# EAGLE design usb-shock-buzzer (EAGLE 7.5.0)
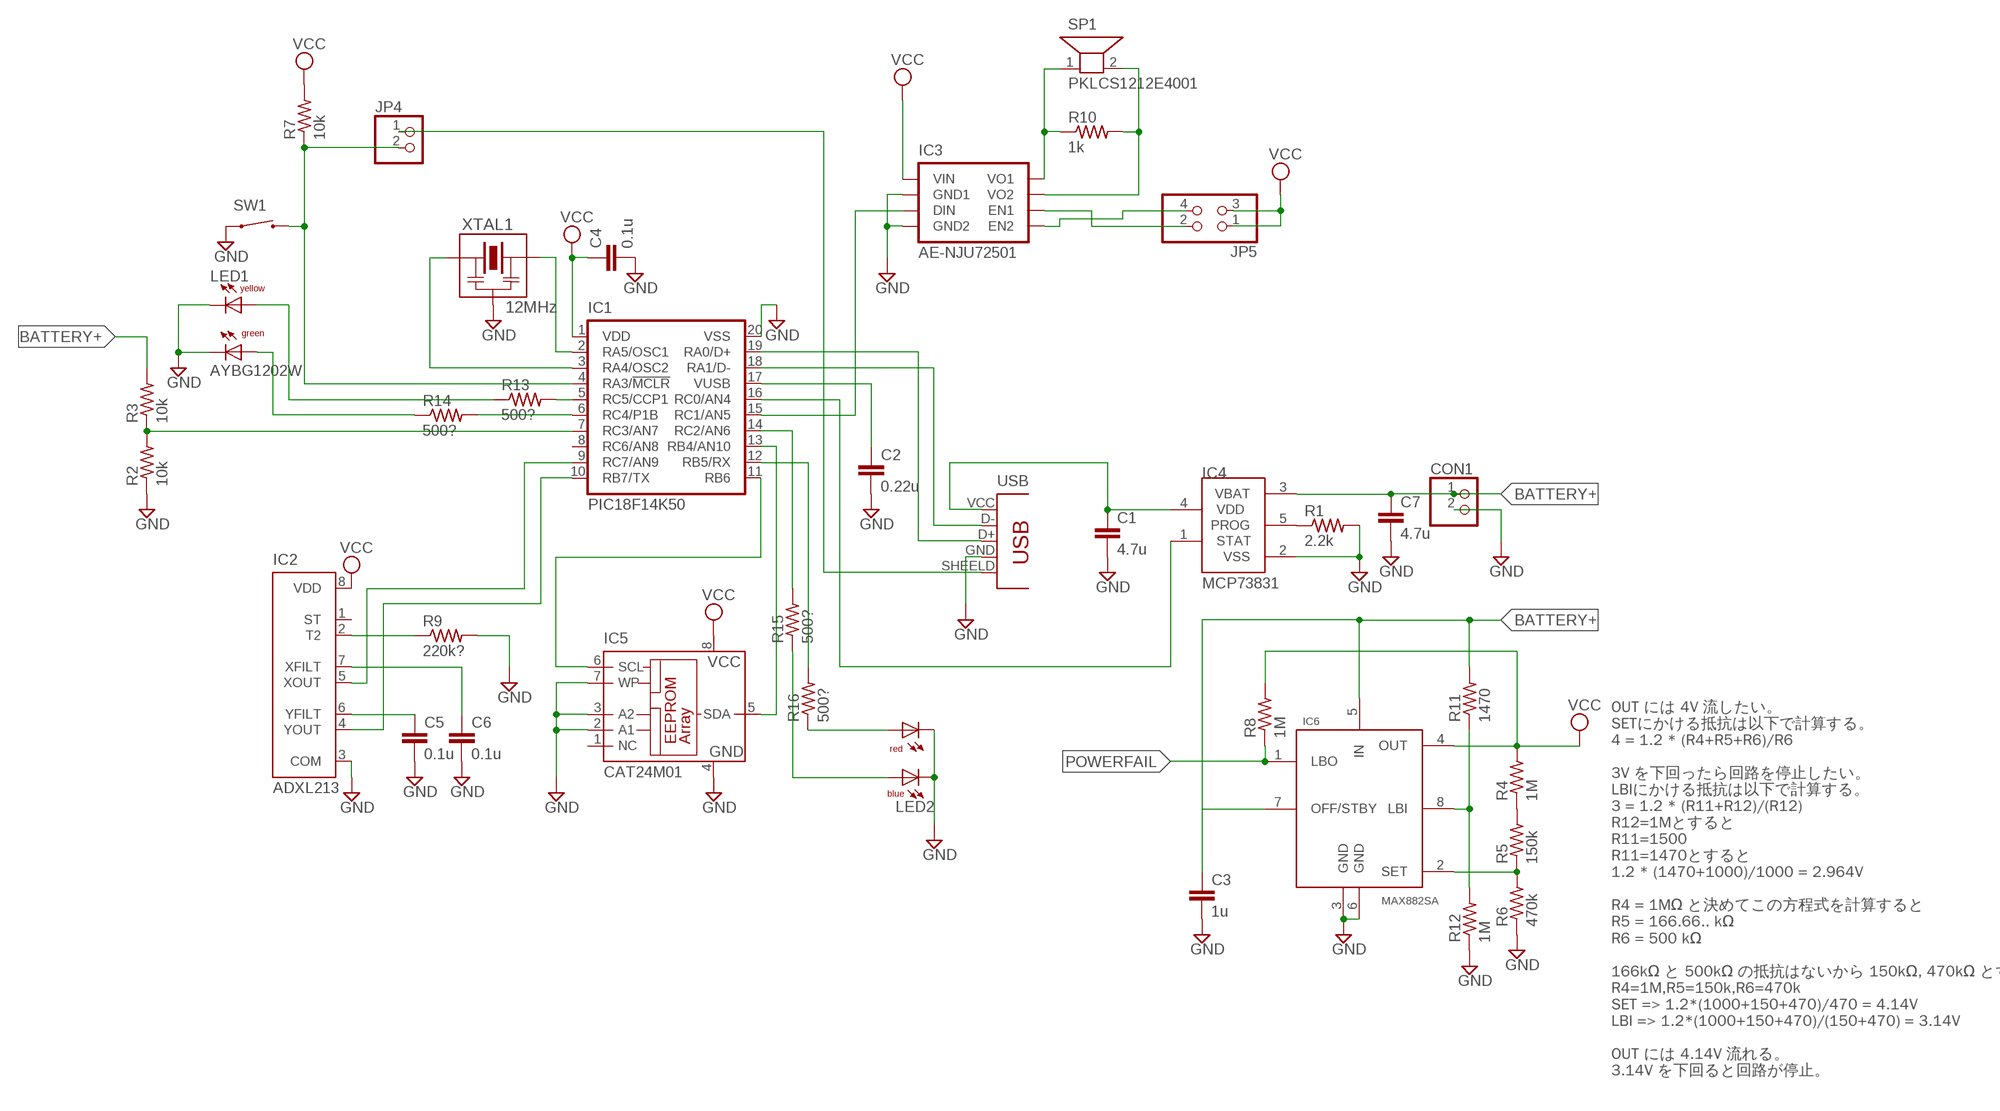
[diagram p0: schematic, sheet 1]

## Parts
C1  4.7u  C-EUC0805  [C0805]
C2  0.22u  C-EUC0805  [C0805]
C3  1u  C-EUC0805  [C0805]
C4  0.1u  C-EUC0805  [C0805]
C5  0.1u  C-EUC0805  [C0805]
C6  0.1u  C-EUC0805  [C0805]
C7  4.7u  C-EUC0805  [C0805]
CON1  PH-2PIN  [PH-2PIN]
IC1  PIC18F14K50  [SO20]
IC2  ADXL213  [LCC8]
IC3  AE-NJU72501  [AE-NJU72501]
IC4  MCP73831  [SOT23-5L]
IC5  CAT24M01  [SOIC]
IC6  MAX882SA  [8-SO]
JP4  PINHD-1X2  [1X02]
JP5  PINHD-2X2  [2X02]
LED1  AYBG1202W  [AYBG1202W]
LED2  2COLOR-BR  [SML-02]
R1  2.2k  R-US_M0805  [M0805]
R2  10k  R-US_M0805  [M0805]
R3  10k  R-US_M0805  [M0805]
R4  1M  R-US_R0805  [R0805]
R5  150k  R-US_M0805  [M0805]
R6  470k  R-US_M0805  [M0805]
R7  10k  R-US_M0805  [M0805]
R8  1M  R-US_M0805  [M0805]
R9  220k?  R-US_M0805  [M0805]
R10  1k  R-US_M1206  [M1206]
R11  1470  R-US_R0805  [R0805]
R12  1M  R-US_R0805  [R0805]
R13  500?  R-US_M0805  [M0805]
R14  500?  R-US_M0805  [M0805]
R15  500?  R-US_M0805  [M0805]
R16  500?  R-US_M0805  [M0805]
SP1  PKLCS1212E4001  [PKLCS1212E4001]
SW1  TVBP06  [TVBP06]
USB  TYPE-A+SHILED  [TYPE-A]
XTAL1  12MHz  CSTCE12M0G15L  [CSTCE]

## Nets
BATTERY+ [Power]: C3.1 C7.1 CON1.1 IC4.3(VBAT) IC6.5(IN) IC6.7(OFF/STBY) R3.2 R11.2
GND [Power]: C1.2 C2.2 C3.2 C4.2 C5.2 C6.2 C7.2 CON1.2 IC1.20(VSS) IC2.3(COM) IC3.2(GND1) IC3.4(GND2) IC4.2(VSS) IC5.2(A1) IC5.3(A2) IC5.4(GND) IC5.7(WP) IC6.3(GND) IC6.6(GND) LED1.2(CC1) LED1.4(CC2) LED2.1(CC1) LED2.3(CC2) R1.2 R2.1 R6.1 R9.2 R12.1 SW1.1 USB.GND XTAL1.2(GND)
N$1: IC3.6(EN1) JP5.2
N$2: IC1.18(RA1/D-) USB.D-
N$3: IC1.19(RA0/D+) USB.D+
N$4: IC4.5(PROG) R1.1
N$5: IC1.16(RC0/AN4) IC4.1(STAT)
N$6: JP4.1 USB.SHEELD
N$7: C2.1 IC1.17(VUSB)
N$8: IC1.7(RC3/AN7) R2.2 R3.1
N$9: R4.1 R5.2
N$10: IC1.11(RB6) IC5.6(SCL)
N$11: IC1.13(RB4/AN10) IC5.5(SDA)
N$12: C5.1 IC2.6(YFILT)
N$13: C6.1 IC2.7(XFILT)
N$14: IC1.9(RC7/AN9) IC2.5(XOUT)
N$15: IC1.10(RB7/TX) IC2.4(YOUT)
N$16: IC3.5(EN2) JP5.4
N$17: IC2.2(T2) R9.1
N$18: IC6.8(LBI) R11.1 R12.2
N$19: IC3.8(VO1) R10.1 SP1.1
N$20: IC3.7(VO2) R10.2 SP1.2
N$21: IC1.4(RA3/!MCLR!) JP4.2 R7.1 SW1.2
N$22: LED1.1(A1) R13.1
N$23: LED1.3(A2) R14.1
N$24: LED2.4(AR) R16.1
N$25: IC1.15(RC1/AN5) IC3.3(DIN)
N$26: IC1.2(RA5/OSC1) XTAL1.3(RIT)
N$27: IC1.14(RC2/AN6) R15.2
N$28: IC1.3(RA4/OSC2) XTAL1.1(LFT)
N$29: IC6.2(SET) R5.1 R6.2
N$30: IC1.5(RC5/CCP1) R13.2
N$31: IC1.6(RC4/P1B) R14.2
N$32: IC1.12(RB5/RX) R16.2
N$33: LED2.2(AB) R15.1
POWERFAIL: IC6.1(LBO) R8.1
USB_VCC [Power]: C1.1 IC4.4(VDD) USB.VCC
VCC [Power]: C4.1 IC1.1(VDD) IC2.8(VDD) IC3.1(VIN) IC5.8(VCC) IC6.4(OUT) JP5.1 JP5.3 R4.2 R7.2 R8.2
Unconnected: IC1.8(RC6/AN8) IC2.1(ST) IC5.1(NC)

## Notes on the sheet
- OUT には 4V 流したい。
  SETにかける抵抗は以下で計算する。
  4 = 1.2 * (R4+R5+R6)/R6
  
  3V を下回ったら回路を停止したい。
  LBIにかける抵抗は以下で計算する。
  3 = 1.2 * (R11+R12)/(R12)
  R12=1Mとすると
  R11=1500
  R11=1470とすると
  1.2 * (1470+1000)/1000 = 2.964V
  
  R4 = 1MΩ と決めてこの方程式を計算すると
  R5 = 166.66.. kΩ
  R6 = 500 kΩ
  
  166kΩ と 500kΩ の抵抗はないから 150kΩ, 470kΩ とする
  R4=1M,R5=150k,R6=470k
  SET => 1.2*(1000+150+470)/470 = 4.14V
  LBI => 1.2*(1000+150+470)/(150+470) = 3.14V
  
  OUT には 4.14V 流れる。
  3.14V を下回ると回路が停止。

## Library data of the parts
C1-C7 = rcl:C-EU: CAPACITOR, European symbol
CON1 = connectors:PH-2PIN
IC1 = pic18f14k50:PIC18F14K50
IC2 = adxl213:ADXL213: Low-Cost +-2 g Dual-Axis Accelerometer with Duty Cycle Output Source: http://www.analog.com/media/en/technical-documentation/data-sheets/ADXL213.pdf
IC3 = ae-nju72501:AE-NJU72501
IC4 = microchip-update:MCP73831: Miniature Single-Cell, Fully Integrated Li-Ion, Li-Polymer Charge Management Controllers
IC5 = cat24m01:CAT24M01: Serial EEPROM 1Mbit (128KB)
IC6 = max882:MAX882*: MAX882 Low-Dropout, Adjustable Linear Regulators 200 mA, 5V/3.3V This is SMD library only. Created by: Razi Raslan; Ragnar Granit Institute; Tampere University of Technology.
JP4 = pinhead:PINHD-1X2: PIN HEADER
JP5 = pinhead:PINHD-2X2: PIN HEADER
LED1 = led-smd:AYBG1202W
LED2 = led-smd:2COLOR-BR: 2color led http://akizukidenshi.com/catalog/g/gI-09437/
R1-R16 = rcl:R-US_: RESISTOR, American symbol
SP1 = pklcs1212e4001-r1:PKLCS1212E4001
SW1 = switches:TVBP06: 2pin switch. http://akizukidenshi.com/catalog/g/gP-08074/
USB = usb-connector:TYPE-A+SHILED
XTAL1 = murata-ceralok:CSTCE12M0G15L: Murata CERALOCK https://jp.rs-online.com/web/p/ceramic-resonators/7926527/

## Net classes
0 default: width 0.305 mm, drill 0.203 mm, clearance 0.254 mm
1 Power: width 0.61 mm, drill 0.508 mm, clearance 0.381 mm

## Board
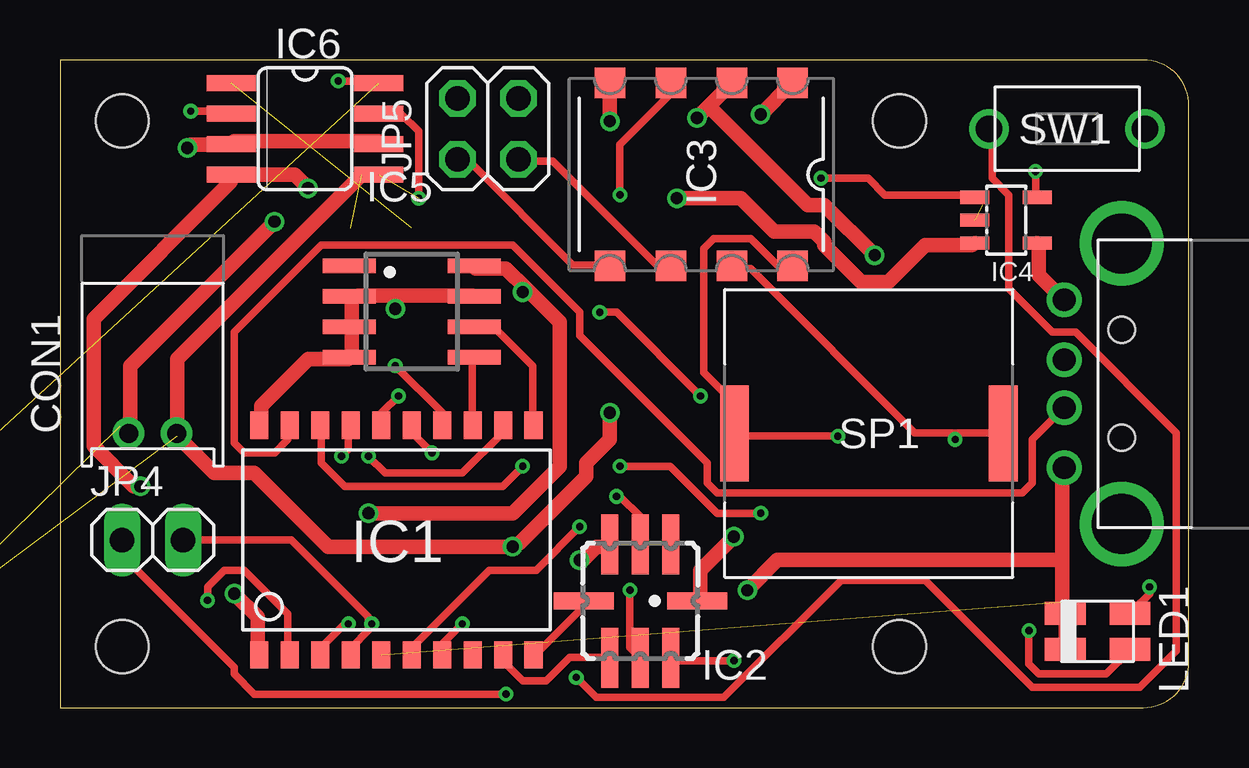
[diagram p1: board, top side]
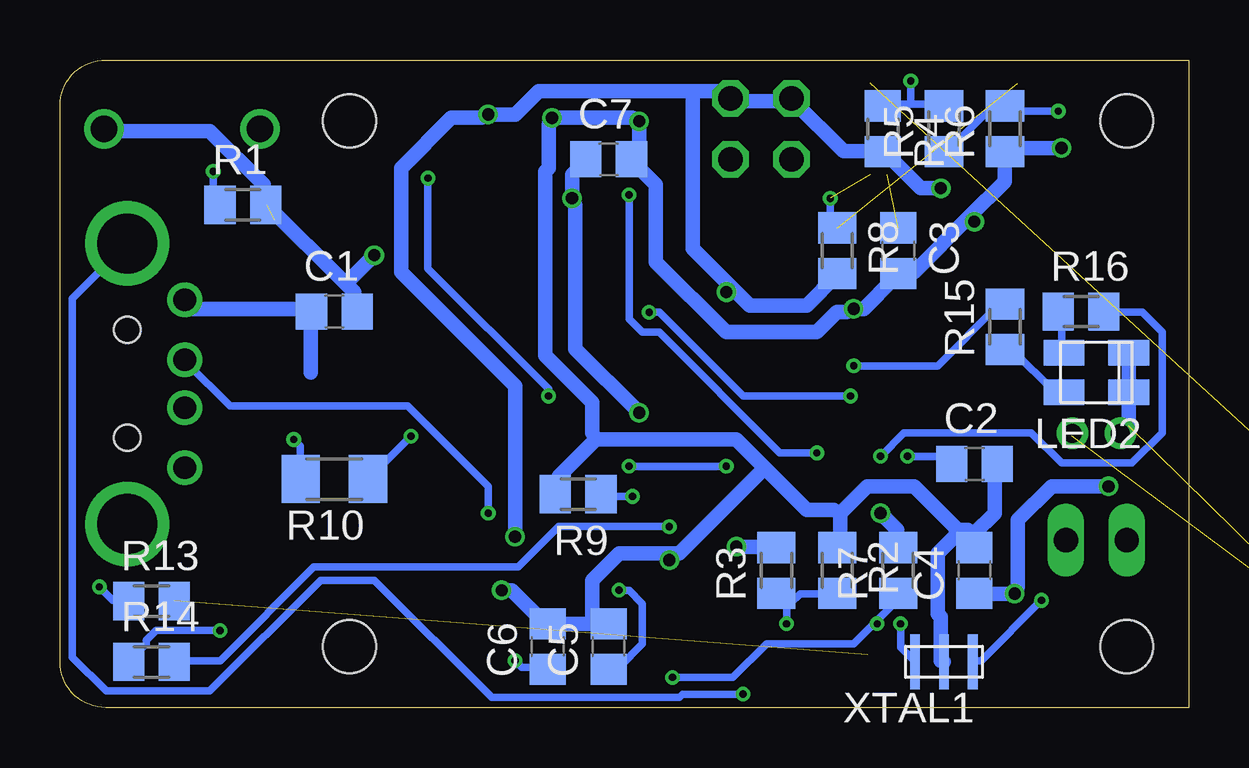
[diagram p2: board, bottom side, seen from below]

Size 47.04 x 27 mm. Coordinates in mm from the lower left corner, seen from the top.
Outline: 0,0 45.14,0 arc90 47.04,1.91 47.04,25.09 arc90 45.14,27 0,27 0,0
Copper layers (1*16): Top 0.035mm / dielectric 1.5mm / Bottom 0.035mm
Design rules "ssci_SeeedStudio_2layer_DRU_no_angle": minimum track width 6mil, minimum drill 12mil, track to track 6mil, track to pad 6mil, pad to pad 6mil, via to via 6mil, smd to smd 0mil, copper to edge 10mil, drill to drill 10mil, minimum pad ring 10mil, minimum via ring 6mil, stop-mask expansion 2mil, vias tented up to drill 25mil, thermal gap 10mil
Holes 2.2 mm at 34.98,24.46 34.98,2.54 2.59,2.54 2.59,24.46
bKeepout: area 11,11 to 17,17
tRestrict: area 0.1,22 to 5.1,27; area 32.5,22 to 37.5,27; area 32.5,0 to 37.5,5; area 0.1,0 to 5.1,5
bRestrict: area 32.5,22 to 37.5,27; area 32.5,0 to 37.5,5; area 0.1,0 to 5.1,5; area 0.1,22 to 5.1,27

### Footprints (pad centres in the part's own frame; a part is rotated, then mirrored left to right if it is on the bottom)
C0805 = smd 1.3 x 1.5: 1 -0.95,0; 2 0.95,0
PH-2PIN = drill 0.8: 1 1,0; 2 -1,0
SO20 = smd 0.762 x 1.143: 1 -5.08,-4.788; 2 -3.81,-4.788; 3 -2.54,-4.788; 4 -1.27,-4.788; 5 0,-4.788; 6 1.27,-4.788; 7 2.54,-4.788; 8 3.81,-4.788; 9 5.08,-4.788; 10 6.35,-4.788; 11 6.35,4.788; 12 5.08,4.788; 13 3.81,4.788; 14 2.54,4.788; 15 1.27,4.788; 16 0,4.788; 17 -1.27,4.788; 18 -2.54,4.788; 19 -3.81,4.788; 20 -5.08,4.788
LCC8 = smd 2.5 x 0.7: 1 -2.367,1.27; 2 -2.367,0; 3 -2.367,-1.27; 5 2.367,-1.27; 6 2.367,0; 7 2.367,1.27 | smd 0.7 x 2.5: 4 0,-2.367; 8 0,2.367
AE-NJU72501 = smd 1.27 x 1.27: 1 -3.81,3.81; 2 -3.81,1.27; 3 -3.81,-1.27; 4 -3.81,-3.81; 5 3.81,-3.81; 6 3.81,-1.27; 7 3.81,1.27; 8 3.81,3.81
SOT23-5L = smd 0.55 x 1.2: 1 -0.95,-1.3; 2 0,-1.3; 3 0.95,-1.3; 4 0.95,1.3; 5 -0.95,1.3
SOIC = smd 0.6 x 2.2: 1 -1.905,-2.6; 2 -0.635,-2.6; 3 0.635,-2.6; 4 1.905,-2.6; 5 1.905,2.6; 6 0.635,2.6; 7 -0.635,2.6; 8 -1.905,2.6
8-SO = smd 2.032 x 0.66: 1 -3.073,1.905; 2 -3.073,0.635; 3 -3.073,-0.635; 4 -3.073,-1.905; 5 3.073,-1.905; 6 3.073,-0.635; 7 3.073,0.635; 8 3.073,1.905
1X02 = drill 1.016 long: 1 -1.27,0; 2 1.27,0
2X02 = drill 1.016 octagon: 1 -1.27,-1.27; 2 -1.27,1.27; 3 1.27,-1.27; 4 1.27,1.27
AYBG1202W = smd 0.95 x 1.7: 1 -0.75,1.35; 2 -0.75,-1.35; 3 0.75,1.35; 4 0.75,-1.35
SML-02 = smd 1.7 x 1.05: 1 -1.35,0.825; 2 1.35,0.825; 3 -1.35,-0.825; 4 1.35,-0.825
M0805 = smd 1.3 x 1.6: 1 -0.95,0; 2 0.95,0
R0805 = smd 1.3 x 1.5: 1 -0.95,0; 2 0.95,0
M1206 = smd 1.6 x 2: 1 -1.4,0; 2 1.4,0
PKLCS1212E4001 = smd 1.2 x 4: 1 -5.6,0; 2 5.6,0
TVBP06 = drill 1.1: 1 -3.25,0; 2 3.25,0
TYPE-A = drill 0.95: D+ 1,0; D- -1,0; GND 3.5,0; VCC -3.5,0 | drill 2.5: SHEELD -5.85,2.4; SHEELD2 5.85,2.4 | hole 1.1: -2.25,2.4; 2.25,2.4
CSTCE = smd 0.4 x 2.3: 1 1.2,0; 2 0,0; 3 -1.2,0

### Placement (x,y rotation side)
C1  35.61,16.51 0 bottom
C2  8.94,10.16 0 bottom
C3  12.11,19.05 270 bottom
C4  8.94,5.71 90 bottom
C5  24.18,2.54 90 bottom
C6  26.72,2.54 90 bottom
C7  24.18,22.86 0 bottom
CON1  3.86,11.43 0 top
IC1  13.38,6.99 0 top
IC2  24.18,4.45 270 top
IC3  26.72,22.23 270 top
IC4  39.42,20.32 270 top
IC5  14.66,16.51 270 top
IC6  10.21,24.13 0 top
JP4  3.86,6.99 0 top
JP5  17.83,24.13 180 top
LED1  43.23,3.17 270 top
LED2  3.86,13.97 180 bottom
R1  39.42,20.95 0 bottom
R2  14.66,5.71 270 bottom
R3  17.2,5.71 90 bottom
R4  12.75,24.13 270 bottom
R5  10.21,24.13 90 bottom
R6  7.67,24.13 90 bottom
R7  12.11,5.71 90 bottom
R8  14.66,19.05 270 bottom
R9  25.45,8.89 180 bottom
R10  35.61,9.53 180 bottom
R11  -26.62,-11.43 0 top  (outside the outline)
R12  -26.62,-17.78 0 top  (outside the outline)
R13  43.23,4.45 0 bottom
R14  43.23,1.91 0 bottom
R15  7.67,15.88 90 bottom
R16  4.5,16.51 0 bottom
SP1  33.7,11.43 0 top
SW1  41.96,24.13 180 top
USB  41.84,13.5 270 top
XTAL1  10.21,1.91 180 bottom

### Tracks (layer width: path | path; a pad name or v marks a point on that pad's centre or on a via)
BATTERY+  (via drill 0.3, 0.51)  (3 unrouted)
  Top 0.305: v14.95,21.23 14.95,24.03 14.25,24.73 13.41,24.73 IC6.7
  Top 0.61: v25.7,21.23 28.36,21.23 29.76,19.84 31.43,19.84 31.85,19.42 31.85,19.28 33.39,17.74 34.51,17.74 36.04,19.28 38,19.28 IC4.3 | IC6.5 12.57,22.21 4.89,14.53 4.89,11.73 CON1.1 4.89,11.32 6.43,9.78 8.1,9.78 11.18,6.71 v18.86,6.71 19.14,6.84 21.93,9.64 21.93,10.2 22.91,11.18 v22.91,12.29
  Bottom 0.305: 14.95,20.12 v14.95,21.23
  Bottom 0.61: C7.1 25.15,22.77 25.7,22.21 v25.7,21.23 25.56,20.95 25.56,14.95 v22.91,12.29 | v18.86,6.71 17.32,6.71 R3.2
GND  (via drill 0.51)  (2 unrouted)
  Top 0.61: IC1.20 8.38,11.87 8.38,12.57 10.34,14.53 12.01,14.53 IC5.4 12.15,14.81 12.15,15.79 IC5.3 12.15,16.07 12.15,17.04 IC5.2 12.43,17.18 13.97,17.18 | 13.97,17.18 17.18,17.18 IC5.7 | IC6.6 13.27,23.61 7.26,23.61 IC6.3 6.84,23.47 5.45,23.47 v5.31,23.33 | v8.94,20.26 2.93,14.25 2.93,11.46 CON1.2 | v13.97,16.62 13.97,17.18 | LED1.4 41.91,2.52 41.91,3.91 LED1.2 41.77,4.19 41.77,6.15 | 41.77,6.15 41.77,9.92 USB.GND | v22.91,24.45 IC3.4 | v26.54,24.59 27.03,25.08 | 27.03,25.08 IC3.2 | v21.65,6.15 21.79,6.15 22.35,6.71 22.91,6.71 IC2.3 | 41.77,6.15 29.9,6.15 v28.64,4.89 | v33.95,18.86 31.85,20.95 31.15,20.95 27.03,25.08
  Bottom 0.61: LED2.3 2.51,14.67 2.51,13.27 LED2.1 2.51,12.85 2.51,11.73 2.79,11.46 CON1.2 | 9.15,20.47 7.68,21.93 7.68,23.05 R6.1 7.4,23.33 v5.31,23.33 | 9.15,20.47 11.45,18.16 12.01,18.16 C3.2 12.29,17.88 13.55,16.62 v13.97,16.62 14.25,16.48 14.67,16.48 15.51,15.65 19.28,15.65 22.21,18.58 22.21,21.79 23.05,22.63 C7.2 23.19,22.91 22.91,23.19 v22.91,24.45 23.19,24.59 v26.54,24.59 26.68,24.31 26.68,22.49 26.82,22.35 26.82,14.67 24.87,12.71 24.87,11.46 24.73,11.18 | v8.94,20.26 9.15,20.47 | 35.13,17.67 38.42,20.95 R1.2 38.56,21.23 38.56,21.79 40.79,24.03 45.12,24.03 SW1.1 | 35.13,17.67 34.78,17.32 34.78,16.62 C1.2 | 8.94,7.26 8.1,8.1 8.1,10.06 C2.2 | C4.2 8.94,7.26 | 14.53,8.1 14.53,6.71 R2.1 | 14.53,8.1 13.41,9.22 11.45,9.22 9.64,7.4 | 9.64,7.4 9.22,7.4 8.94,7.26 | 24.73,11.18 26.26,9.64 26.26,8.94 R9.2 | 24.73,11.18 18.86,11.18 17.67,9.99 | 17.67,9.99 15.92,8.24 14.81,8.24 14.53,8.1 | XTAL1.2 10.34,1.96 10.34,3.77 10.48,3.91 10.48,6.43 9.78,7.12 9.64,7.4 | 21.65,6.43 21.23,6.43 17.67,9.99 | 21.65,6.43 23.75,6.43 24.87,5.31 24.87,3.77 C5.2 24.31,3.49 26.68,3.49 C6.2 26.96,3.63 28.22,4.89 v28.64,4.89 | v21.65,6.15 21.65,6.43 | v33.95,18.86 35.13,17.67
N$1
  Top 0.305: IC3.6 25.42,18.44 24.87,18.44 20.53,22.77 19.14,22.77 JP5.2
N$2  (via drill 0.3)
  Top 0.305: v19.28,10.06 18.44,9.22 11.87,9.22 10.9,10.2 10.9,11.73 IC1.18 | v23.33,10.06 25.42,10.06 27.38,8.1 v29.2,8.1
  Bottom 0.305: v23.33,10.06 v19.28,10.06 | v29.2,8.1 29.2,9.22 32.55,12.57 39.95,12.57 41.77,14.39 USB.D-
N$3
  Top 0.305: IC1.19 9.5,11.73 9.5,11.18 8.94,10.62 7.68,10.62 7.26,11.04 7.26,15.65 10.9,19.28 18.86,19.28 21.65,16.48 21.65,15.51 26.96,10.2 26.96,9.36 27.38,8.94 40.09,8.94 40.51,9.36 40.51,11.18 41.77,12.43 USB.D+
N$4  (via drill 0.3)
  Top 0.305: v40.65,22.35 40.65,21.37 IC4.5
  Bottom 0.305: v40.65,22.35 40.65,21.23 R1.1
N$5  (via drill 0.3)
  Top 0.305: v14.11,12.99 13.41,12.29 13.41,11.87 IC1.16 | v22.49,16.48 23.19,16.48 v26.68,12.99 | v31.71,22.07 33.67,22.07 34.37,21.37 38,21.37 IC4.1
  Bottom 0.305: v14.11,12.99 18.58,12.99 22.07,16.48 v22.49,16.48 | v26.68,12.99 26.68,13.27 31.71,18.3 v31.71,22.07
N$6  (via drill 0.3)
  Top 0.305: v18.58,0.56 8.1,0.56 7.26,1.4 7.26,1.68 2.65,6.29 2.65,6.99 JP4.1
  Bottom 0.305: v18.58,0.56 21.09,0.56 21.23,0.42 29.06,0.42 33.95,5.31 36.18,5.31 40.79,0.7 45.12,0.7 46.52,2.1 46.52,17.04 44.28,19.28 USB.SHEELD
N$7  (via drill 0.3)
  Top 0.305: v11.73,10.48 12.01,10.76 12.01,11.73 IC1.17
  Bottom 0.305: v11.73,10.48 10.2,10.48 9.92,10.2 C2.1
N$8  (via drill 0.3)
  Top 0.305: IC1.7 15.92,2.65 v16.76,3.49
  Bottom 0.305: v16.76,3.49 16.76,4.33 17.18,4.75 R3.1 16.62,4.33 16.2,4.75 R2.2
N$9  (via drill 0.3)
  Top 0.305: v11.59,26.12 13.27,26.12
  Bottom 0.305: 11.59,25.15 10.34,25.15 R5.2 | 11.59,25.15 12.71,25.15 R4.1 | 11.59,25.15 v11.59,26.12
N$10
  Top 0.305: IC1.11 19.7,11.87 19.7,14.25 18.16,15.79 17.32,15.79 IC5.6
N$11
  Top 0.305: IC1.13 17.18,11.87 17.18,14.53 IC5.5
N$12  (via drill 0.3)
  Top 0.305: v23.75,4.89 23.75,2.52 24.17,2.1 IC2.6
  Bottom 0.305: v23.75,4.89 23.33,4.89 22.77,4.33 22.77,2.65 23.75,1.68 24.17,1.68 C5.1
N$13  (via drill 0.3)
  Top 0.305: v28.08,1.96 25.56,1.96 IC2.7
  Bottom 0.305: v28.08,1.96 27.8,1.68 26.82,1.68 C6.1
N$14
  Top 0.305: IC1.9 18.58,2.1 18.58,1.82 19.28,1.12 20.26,1.12 21.23,2.1 22.91,2.1 IC2.5
N$15
  Top 0.305: IC1.10 19.84,2.23 21.93,4.33 IC2.4
N$16
  Top 0.305: IC3.5 22.91,18.44 21.37,18.44 17.04,22.77 16.62,22.77 JP5.4
N$17  (via drill 0.3)
  Top 0.305: v23.19,8.8 23.33,8.8 24.17,7.96 24.17,6.84 IC2.2
  Bottom 0.305: v23.19,8.8 24.45,8.8 R9.1
N$18  (2 unrouted)
N$19  (via drill 0.3)
  Top 0.305: IC3.8 30.45,18.44 29.9,18.44 28.78,19.56 27.24,19.56 26.82,19.14 26.82,13.97 28.08,12.71 28.08,11.46 SP1.1 28.22,11.32 v32.41,11.32
  Bottom 0.305: v32.41,11.32 34.09,9.64 R10.1
N$20  (via drill 0.3)
  Top 0.305: 37.3,11.46 39.26,11.46 SP1.2 | 37.3,11.46 35.62,11.46 28.78,18.3 28.08,18.3 IC3.7 | v37.3,11.18 37.3,11.46
  Bottom 0.305: v37.3,11.18 37.02,10.9 37.02,9.64 R10.2
N$21  (via drill 0.3)
  Top 0.305: 12.85,3.49 12.85,3.77 9.64,6.99 JP4.2 | 12.85,3.49 12.85,3.21 12.15,2.52 12.15,2.23 IC1.4 | v12.99,3.49 12.85,3.49 | v21.51,1.26 22.35,0.42 27.66,0.42 32.55,5.31 36.04,5.31 40.51,0.84 44.98,0.84 46.52,2.38 46.52,11.46 42.33,15.65 41.35,15.65 39.53,17.46 39.53,21.37 38.84,22.07 38.84,24.03 SW1.2
  Bottom 0.305: R7.1 12.15,4.75 12.15,4.47 12.99,3.63 v12.99,3.49 13.13,3.49 13.97,2.65 17.6,2.65 19,1.26 v21.51,1.26
N$22  (via drill 0.3)
  Top 0.305: v45.4,5.03 45.4,4.75 44.7,4.05 LED1.1
  Bottom 0.305: v45.4,5.03 44.84,4.47 44.28,4.47 R13.1
N$23  (via drill 0.3)
  Top 0.305: v40.37,3.21 40.37,1.82 40.79,1.4 43.59,1.4 44.56,2.38 LED1.3
  Bottom 0.305: v40.37,3.21 43.03,3.21 43.45,2.79 43.45,2.65 44.14,1.96 R14.1
N$24
  Bottom 0.305: R16.1 5.31,16.48 5.31,14.81 LED2.4
N$25  (via drill 0.3)
  Top 0.305: v15.51,10.62 14.67,11.46 14.67,11.73 IC1.15 | v23.33,21.37 23.33,23.47 25.42,25.57 25.42,25.98 IC3.3
  Bottom 0.305: v15.51,10.62 17.04,10.62 22.07,15.65 22.77,15.65 23.33,16.2 v23.33,21.37
N$26  (via drill 0.3)
  Top 0.305: v6.15,4.47 6.15,5.03 6.84,5.73 7.68,5.73 9.5,3.91 9.5,2.23 IC1.2
  Bottom 0.305: v6.15,4.47 8.66,1.96 8.94,1.96 XTAL1.3
N$27  (via drill 0.3)
  Top 0.305: IC1.14 15.92,12.29 v13.97,14.25
  Bottom 0.305: v13.97,14.25 10.48,14.25 7.96,16.76 7.68,16.76 R15.2
N$28  (via drill 0.3)
  Top 0.305: v12.01,3.49 11.87,3.49 10.9,2.52 10.9,2.23 IC1.3
  Bottom 0.305: v12.01,3.49 12.01,2.52 11.45,1.96 XTAL1.1
N$29  (via drill 0.3)
  Top 0.305: v5.45,24.87 7.12,24.87 IC6.2
  Bottom 0.305: R5.1 10.2,23.05 8.24,25.01 7.68,25.01 R6.2 7.68,24.87 v5.45,24.87
N$30  (1 unrouted)
N$31  (via drill 0.3)
  Top 0.305: v21.65,7.54 19.84,5.73 17.88,5.73 14.67,2.52 14.67,2.23 IC1.6
  Bottom 0.305: v21.65,7.54 26.26,7.54 27.94,5.87 36.46,5.87 40.37,1.96 42.19,1.96 R14.2
N$32  (via drill 0.3)
  Top 0.305: v12.85,10.48 13.55,9.78 16.76,9.78 18.44,11.46 18.44,11.73 IC1.12
  Bottom 0.305: v12.85,10.48 11.87,11.46 6.57,11.46 5.31,10.2 2.37,10.2 1.12,11.46 1.12,15.65 1.95,16.48 3.49,16.48 R16.2
N$33
  Bottom 0.305: R15.1 7.54,14.81 7.26,14.81 5.73,13.27 5.31,13.27 LED2.2
POWERFAIL  (1 unrouted)
USB_VCC
  Top 0.61: IC4.4 40.79,19.28 40.79,18.02 41.77,17.04 USB.VCC
  Bottom 0.61: 36.6,13.97 36.6,16.48 C1.1 36.88,16.62 41.49,16.62 41.77,16.9 USB.VCC
VCC  (via drill 0.51)
  Top 0.61: v7.26,4.75 8.24,3.77 8.24,2.23 IC1.1 | v10.34,21.65 9.78,22.21 7.26,22.21 IC6.4 7.12,21.93 1.4,16.2 1.4,10.9 3.07,9.22 v3.35,9.22 | v12.85,8.1 18.86,8.1 20.81,10.06 20.81,16.07 19.42,17.46 | 19.42,17.46 18.58,18.3 17.32,18.3 IC5.8 | v29.2,24.73 30.45,25.98 IC3.1 | v28.08,7.12 26.68,5.73 26.68,4.47 IC2.8 | v19.28,17.32 19.42,17.46
  Bottom 0.61: C4.1 v7.26,4.75 7.12,5.03 7.12,7.82 5.73,9.22 v3.35,9.22 | v10.34,21.65 11.18,21.65 12.57,23.05 R4.2 12.85,23.19 14.39,23.19 16.48,25.29 JP5.3 16.76,25.29 18.86,25.29 JP5.1 19.14,25.43 19.42,25.7 20.67,25.7 | v12.85,8.1 12.15,7.4 12.15,6.71 R7.2 | 20.67,25.7 27.1,25.7 28.08,24.73 v29.2,24.73 29.48,24.59 30.73,24.59 32.83,22.49 32.83,18.16 28.08,13.41 v28.08,7.12 | 19.07,17.53 20.67,19.14 20.67,25.7 | 19.07,17.53 18.3,16.76 15.92,16.76 14.67,18.02 R8.2 | v19.28,17.32 19.07,17.53